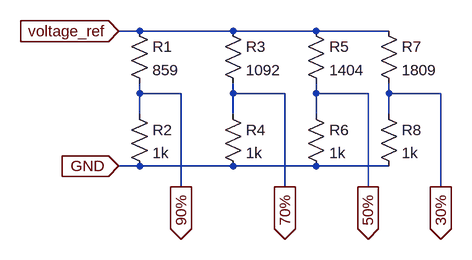
[diagram p0: schematic Referencia.asc]
Referencia.asc, the LTspice schematic file:
Version 4
SHEET 1 880 680
WIRE 112 64 80 64
WIRE 256 64 112 64
WIRE 384 64 256 64
WIRE 496 64 384 64
WIRE 112 160 112 144
WIRE 176 160 112 160
WIRE 256 160 256 144
WIRE 336 160 256 160
WIRE 384 160 384 144
WIRE 464 160 384 160
WIRE 496 160 496 144
WIRE 576 160 496 160
WIRE 112 192 112 160
WIRE 256 192 256 160
WIRE 384 192 384 160
WIRE 496 192 496 160
WIRE 112 272 80 272
WIRE 256 272 112 272
WIRE 384 272 256 272
WIRE 496 272 384 272
WIRE 176 304 176 160
WIRE 336 304 336 160
WIRE 464 304 464 160
WIRE 576 304 576 160
FLAG 80 64 voltage_ref
IOPIN 80 64 In
FLAG 80 272 GND
IOPIN 80 272 In
FLAG 576 304 30%
IOPIN 576 304 Out
FLAG 464 304 50%
IOPIN 464 304 Out
FLAG 336 304 70%
IOPIN 336 304 Out
FLAG 176 304 90%
IOPIN 176 304 Out
SYMBOL res 96 48 R0
SYMATTR InstName R1
SYMATTR Value 859
SYMBOL res 96 176 R0
SYMATTR InstName R2
SYMATTR Value 1k
SYMBOL res 240 48 R0
SYMATTR InstName R3
SYMATTR Value 1092
SYMBOL res 240 176 R0
SYMATTR InstName R4
SYMATTR Value 1k
SYMBOL res 368 48 R0
SYMATTR InstName R5
SYMATTR Value 1404
SYMBOL res 368 176 R0
SYMATTR InstName R6
SYMATTR Value 1k
SYMBOL res 480 48 R0
SYMATTR InstName R7
SYMATTR Value 1809
SYMBOL res 480 176 R0
SYMATTR InstName R8
SYMATTR Value 1k

The netlist it stands for:
* Referencia.asc
R1 voltage_ref 90% 859
R2 90% GND 1k
R3 voltage_ref 70% 1092
R4 70% GND 1k
R5 voltage_ref 50% 1404
R6 50% GND 1k
R7 voltage_ref 30% 1809
R8 30% GND 1k
.backanno
.end